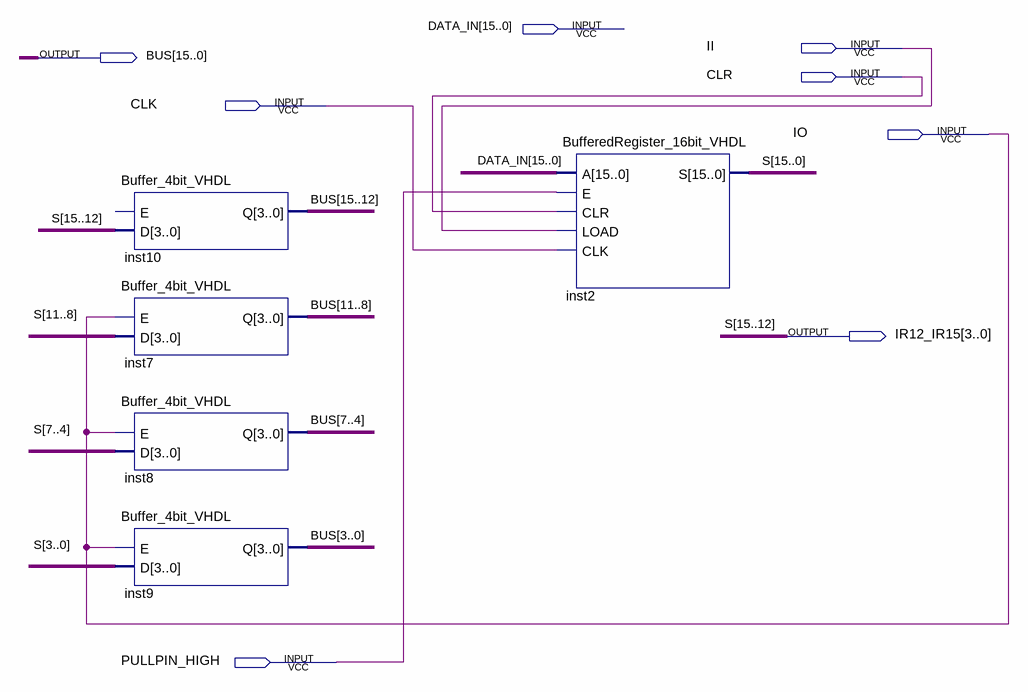
[diagram p0: schematic sheet]
// Quartus schematic InstrReg16_4bit.bdf as structural Verilog: 5 symbols, 8 pins
module InstrReg16_4bit (
  input  [15:0] DATA_IN,
  input  II,
  input  CLR,
  input  CLK,
  input  IO,
  input  PULLPIN_HIGH,
  output [15:0] BUS,
  output [3:0] IR12_IR15
);

  wire [11:0] S;

  Buffer_4bit_VHDL inst10 (.D(IR12_IR15), .Q(BUS[15:12]));  // open: E
  Buffer_4bit_VHDL inst7 (.E(IO), .D(S[11:8]), .Q(BUS[11:8]));
  Buffer_4bit_VHDL inst8 (.E(IO), .D(S[7:4]), .Q(BUS[7:4]));
  Buffer_4bit_VHDL inst9 (.E(IO), .D(S[3:0]), .Q(BUS[3:0]));
  BufferedRegister_16bit_VHDL inst2 (
    .A(DATA_IN), .E(PULLPIN_HIGH), .CLR(CLR), .LOAD(II), .CLK(CLK), .S({IR12_IR15, S}));

  // Other names for the same wires on the sheet: S[15:12] = IR12_IR15
endmodule
